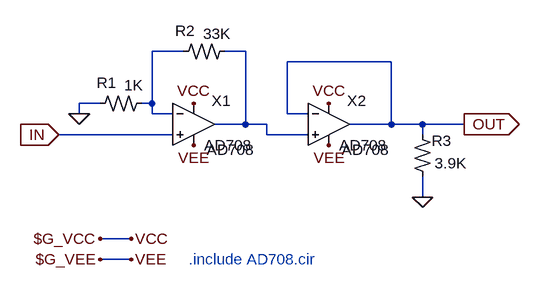
[diagram p0: schematic Boltz-3-postamp.asc]
Boltz-3-postamp.asc, the LTspice schematic file:
Version 4
SHEET 1 880 680
WIRE 336 176 288 176
WIRE 432 176 400 176
WIRE 656 192 496 192
WIRE 208 256 176 256
WIRE 288 256 288 176
WIRE 288 256 272 256
WIRE 176 272 176 256
WIRE 288 272 288 256
WIRE 320 272 288 272
WIRE 496 272 496 192
WIRE 528 272 496 272
WIRE 432 288 432 176
WIRE 432 288 384 288
WIRE 464 288 432 288
WIRE 656 288 656 192
WIRE 656 288 592 288
WIRE 704 288 656 288
WIRE 768 288 704 288
WIRE 320 304 144 304
WIRE 464 304 464 288
WIRE 528 304 464 304
WIRE 704 304 704 288
WIRE 704 400 704 368
WIRE 256 464 208 464
WIRE 256 496 208 496
FLAG 560 256 VCC
FLAG 352 256 VCC
FLAG 256 464 VCC
FLAG 560 320 VEE
FLAG 352 320 VEE
FLAG 256 496 VEE
FLAG 176 272 0
FLAG 704 400 0
FLAG 768 288 OUT
IOPIN 768 288 Out
FLAG 208 464 $G_VCC
FLAG 208 496 $G_VEE
FLAG 144 304 IN
IOPIN 144 304 In
SYMBOL Opamps/UniversalOpamp2 352 288 R0
WINDOW 0 28 -36 Left 2
WINDOW 38 20 39 Left 2
SYMATTR InstName X1
SYMATTR SpiceModel AD708
SYMATTR Value AD708
SYMBOL Opamps/UniversalOpamp2 560 288 R0
WINDOW 0 28 -36 Left 2
WINDOW 38 20 39 Left 2
SYMATTR InstName X2
SYMATTR SpiceModel AD708
SYMATTR Value AD708
SYMBOL res2 272 240 R90
WINDOW 0 0 54 VBottom 2
WINDOW 3 -28 12 VTop 2
SYMATTR InstName R1
SYMATTR Value 1K
SYMBOL res2 400 160 R90
WINDOW 0 0 61 VBottom 2
WINDOW 3 -27 12 VTop 2
SYMATTR InstName R2
SYMATTR Value 33K
SYMBOL res2 720 368 R180
WINDOW 0 -29 55 Left 2
WINDOW 3 -52 20 Left 2
SYMATTR InstName R3
SYMATTR Value 3.9K
TEXT 344 496 Left 2 ;.include AD708.cir

The netlist it stands for:
* Boltz-3-postamp.asc
XX1 IN N001 $G_VCC $G_VEE N002 AD708 AD708 Avol=1Meg GBW=10Meg Slew=10Meg ilimit=25m rail=0 Vos=0 phimargin=45 en=0 enk=0 in=0 ink=0 Rin=500Meg  ; pins IN+ IN- V+ V- OUT
XX2 N002 OUT $G_VCC $G_VEE OUT AD708 AD708 Avol=1Meg GBW=10Meg Slew=10Meg ilimit=25m rail=0 Vos=0 phimargin=45 en=0 enk=0 in=0 ink=0 Rin=500Meg  ; pins IN+ IN- V+ V- OUT
R1 N001 0 1K
R2 N002 N001 33K
R3 0 OUT 3.9K
* .include AD708.cir
.lib UniversalOpamps2.sub
.backanno
.end